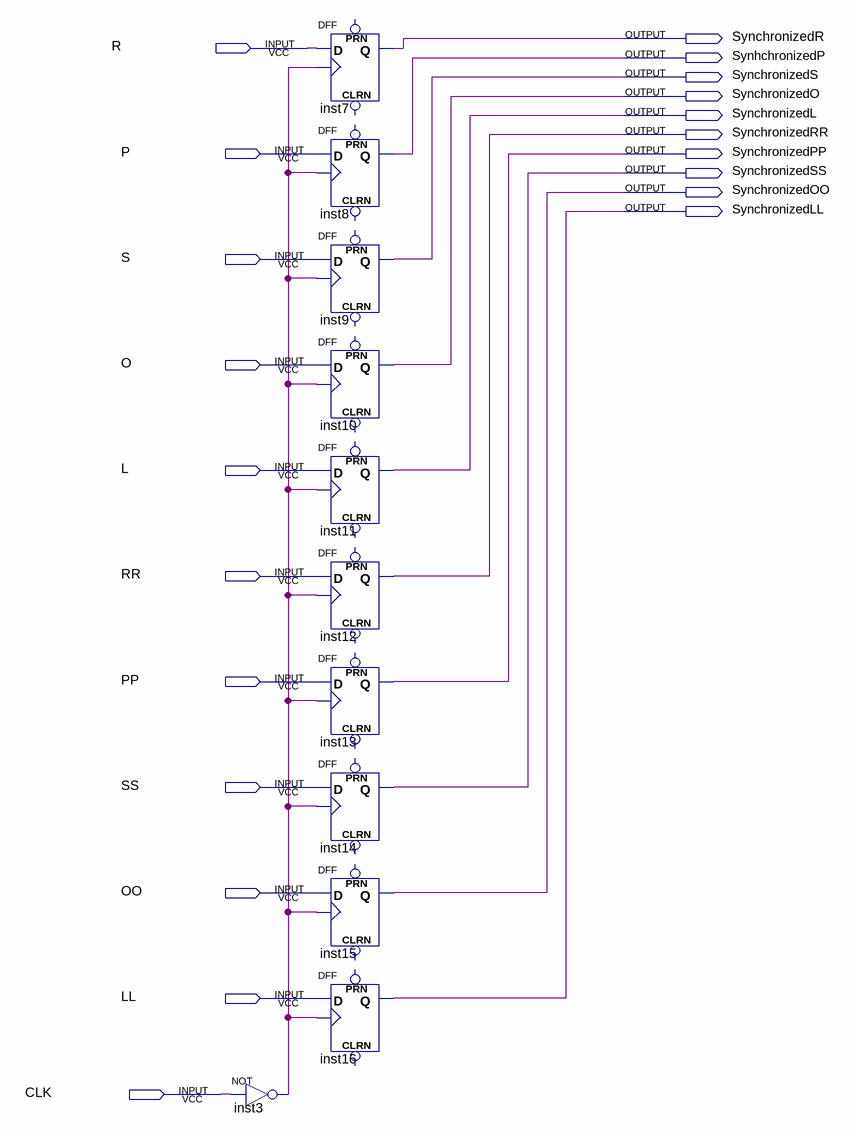
[diagram p0: schematic sheet]
// Quartus schematic InputsDFF.bdf as structural Verilog: 11 symbols, 21 pins
module InputsDFF (
  input  R,
  input  P,
  input  S,
  input  O,
  input  L,
  input  RR,
  input  PP,
  input  SS,
  input  OO,
  input  LL,
  input  CLK,
  output SynchronizedR,
  output SynhchronizedP,
  output SynchronizedS,
  output SynchronizedO,
  output SynchronizedL,
  output SynchronizedRR,
  output SynchronizedPP,
  output SynchronizedSS,
  output SynchronizedOO,
  output SynchronizedLL
);

  wire inst3_out;

  not inst3 (inst3_out, CLK);
  DFF inst7 (.CLK(inst3_out), .D(R), .Q(SynchronizedR));  // open: CLRN, PRN
  DFF inst8 (.CLK(inst3_out), .D(P), .Q(SynhchronizedP));  // open: CLRN, PRN
  DFF inst9 (.CLK(inst3_out), .D(S), .Q(SynchronizedS));  // open: CLRN, PRN
  DFF inst10 (.CLK(inst3_out), .D(O), .Q(SynchronizedO));  // open: CLRN, PRN
  DFF inst11 (.CLK(inst3_out), .D(L), .Q(SynchronizedL));  // open: CLRN, PRN
  DFF inst12 (.CLK(inst3_out), .D(RR), .Q(SynchronizedRR));  // open: CLRN, PRN
  DFF inst13 (.CLK(inst3_out), .D(PP), .Q(SynchronizedPP));  // open: CLRN, PRN
  DFF inst14 (.CLK(inst3_out), .D(SS), .Q(SynchronizedSS));  // open: CLRN, PRN
  DFF inst15 (.CLK(inst3_out), .D(OO), .Q(SynchronizedOO));  // open: CLRN, PRN
  DFF inst16 (.CLK(inst3_out), .D(LL), .Q(SynchronizedLL));  // open: CLRN, PRN
endmodule
